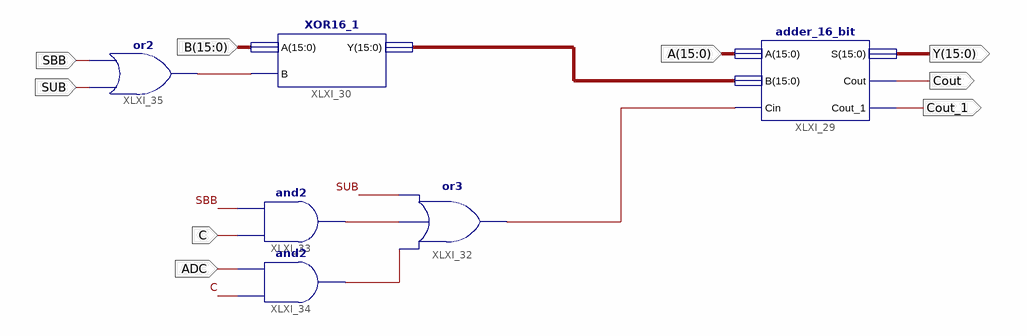
[diagram p0: schematic sheet 1]
// Xilinx ISE schematic ALU.sch (virtex6) as structural Verilog: 6 symbols, 9 ports
module ALU (
  input  [15:0] A,
  input  [15:0] B,
  input  SBB,
  input  SUB,
  input  C,
  input  ADC,
  output [15:0] Y,
  output Cout,
  output Cout_1
);

  wire XLXN_2, XLXN_6, XLXN_8, XLXN_15;
  wire [15:0] XLXN_5;

  adder_16_bit XLXI_29 (.A(A), .B(XLXN_5), .Cin(XLXN_6), .Cout(Cout), .Cout_1(Cout_1), .S(Y));
  XOR16_1 XLXI_30 (.A(B), .B(XLXN_2), .Y(XLXN_5));
  or XLXI_32 (XLXN_6, XLXN_15, XLXN_8, SUB);
  and XLXI_33 (XLXN_8, C, SBB);
  and XLXI_34 (XLXN_15, C, ADC);
  or XLXI_35 (XLXN_2, SUB, SBB);
endmodule
